# Altium schematic sheet 04_Fan_Control.SchDoc
size A4; Author: Sasa Karanovic; Organization: Altium Limited; sk_Title: Fan Control; DocumentNumber: 1; SheetNumber: 4; SheetTotal: 5
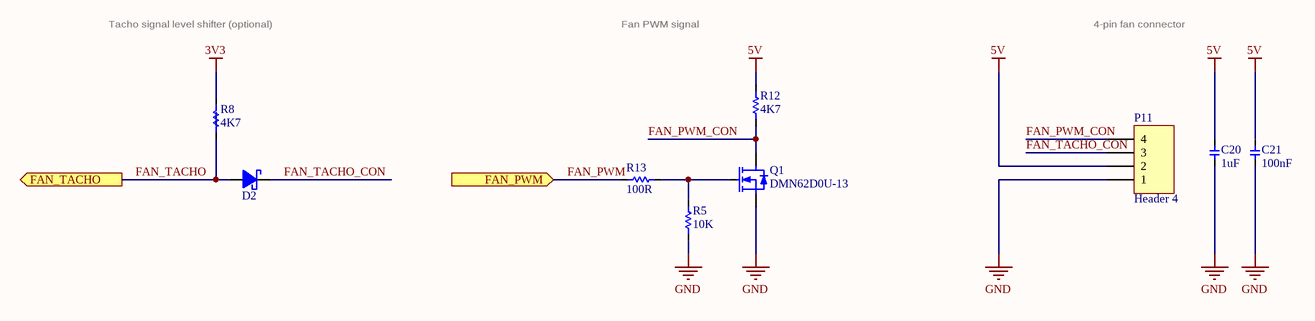
[diagram p0: 04_Fan_Control.SchDoc]

## Parts
C20  value 1uF  [0603 - CAP HS]  (hidden comment: Cap)
C21  value 100nF  [0603 - CAP HS]  (hidden comment: Cap)
D2  Diode Schotky  [SOD123F]  (value not drawn)
P11  Header 4  [Header 4x1]
Q1  DMN62D0U-13  [SOT90P240X100-3N]
R5  value 10K  [0603 - HS]  (hidden comment: Res)
R8  value 4K7  [0603 - HS]  (hidden comment: Res)
R12  value 4K7  [0603 - HS]  (hidden comment: Res)
R13  value 100R  [0603 - HS]  (hidden comment: Res)

## Ports
FAN_PWM (in), FAN_TACHO (out)

## Nets
3V3: R8.2
5V: C20.1 C21.1 P11.2 R12.2
GND: C20.2 C21.2 P11.1 Q1.2(S) R5.2
FAN_PWM: R13.2 ; port FAN_PWM
FAN_PWM_CON: P11.4 Q1.3(D) R12.1
FAN_TACHO: D2.A R8.1 ; port FAN_TACHO
FAN_TACHO_CON: D2.K P11.3
NetQ1_1: Q1.1(G) R5.1 R13.1

## Notes on the sheet
- Tacho signal level shifter (optional)
- Fan PWM signal
- 4-pin fan connector
- Page
- Title
- www.SasaKaranovic.com <http://www.SasaKaranovic.com>
- of

## Library data of the parts
C20 = Cap: Capacitor; Manufacturer: Samsung Electro-Mechanics; Manufacturer Part Number: CL10A105KB8NNNC; Distributor Part Number: 1276-1860-1-ND; Distributor: DigiKey
C21 = Cap: Capacitor; Manufacturer: Samsung Electro-Mechanics; Manufacturer Part Number: CL10B103KB8NNNC; Distributor Part Number: 1276-1009-1-ND; Distributor: DigiKey
D2 = Diode Schotky: Manufacturer: Nexperia USA Inc.; Manufacturer Part Number: PMEG6010CEH,115; Distributor: DigiKey; Distributor Part Number: 1727-3848-1-ND
P11 = Header 4: Header, 4-Pin
Q1 = DMN62D0U-13: MOSFET N-CH 60V 0.38A; Manufacturer: Diodes Incorporated; Manufacturer Part Number: DMN62D0U-13; Distributor: DigiKey; Distributor Part Number: DMN62D0U-13DICT-ND
R5 = Res: Resistor; Manufacturer: Stackpole Electronics Inc; Manufacturer Part Number: RMCF0603JT10K0; Distributor: DigiKey; Distributor Part Number: RMCF0603JT10K0CT-ND
R8 R12 = Res: Resistor; Manufacturer: Stackpole Electronics Inc; Manufacturer Part Number: RMCF0603FT4K70; Distributor: DigiKey; Distributor Part Number: RMCF0603FT4K70CT-ND
R13 = Res: Resistor; Manufacturer: Stackpole Electronics Inc; Manufacturer Part Number: RMCF0603FT100R; Distributor: DigiKey; Distributor Part Number: RMCF0603FT100RCT-ND